# EAGLE design Transmitter Board_REV_2 (EAGLE 5.07)
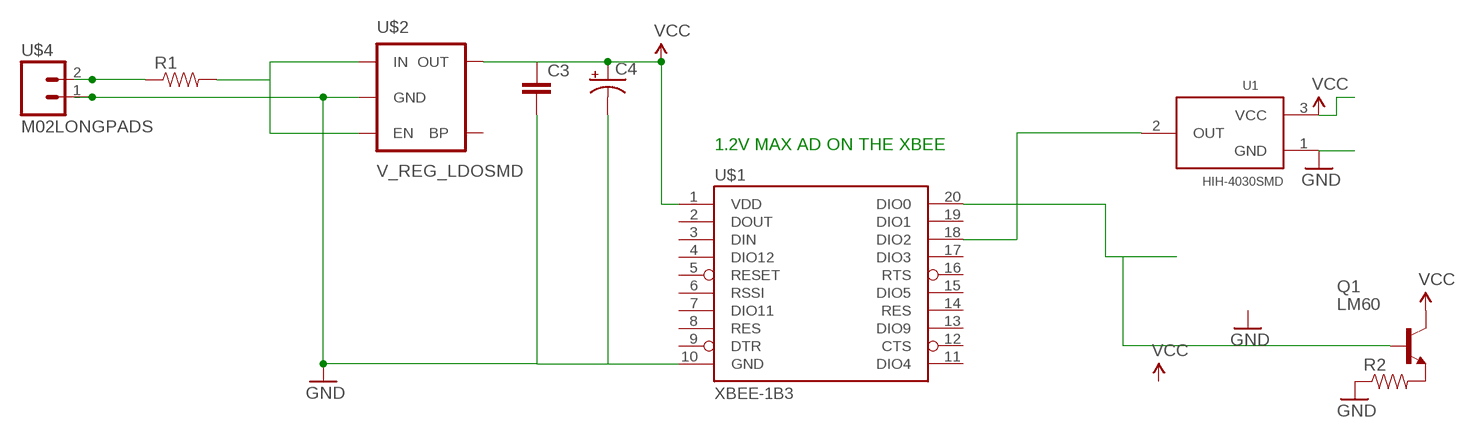
[diagram p0: schematic, sheet 1]

## Parts
C3  CAP0805  [0805]
C4  CAP_POL1206  [EIA3216]
Q1  LM60  BC487  [TO92-EBC]
R1  RESISTOR1206  [1206]
R2  RESISTOR1206  [1206]
U1  HIH-4030SMD  [HIH-4030]
U$1  XBEE-1B3  [XBEE-SMD]
U$2  V_REG_LDOSMD  [SOT23-5]
U$4  M02LONGPADS  [A19423-ELON]

## Nets
GND: C3.2 C4.C(-) R2.1 U1.1(GND) U$1.10(GND) U$2.2(GND) U$4.1
N$1: R1.2 U$2.1(IN) U$2.3(EN)
N$2: U1.2(OUT) U$1.18(DIO2)
N$3: R1.1 U$4.2
N$4: Q1.E R2.2
N$5: Q1.B U$1.20(DIO0)
VCC: C3.1 C4.A(+) Q1.C U1.3(VCC) U$1.1(VDD) U$2.5(OUT)
Unconnected: U$1.2(DOUT) U$1.3(DIN) U$1.4(DIO12) U$1.5(RESET) U$1.6(RSSI) U$1.7(DIO11) U$1.8(RES) U$1.9(DTR) U$1.11(DIO4) U$1.12(CTS) U$1.13(DIO9) U$1.14(RES) U$1.15(DIO5) U$1.16(RTS) U$1.17(DIO3) U$1.19(DIO1) U$2.4(BP)

## Notes on the sheet
- 1.2V MAX AD ON THE XBEE

## Library data of the parts
C3 = SparkFun:CAP: Capacitor Standard 0603 ceramic capacitor, and 0.1" leaded capacitor.
C4 = SparkFun:CAP_POL: Capacitor Polarized These are standard SMD and PTH capacitors. Normally 10uF, 47uF, and 100uF in electrolytic and tantalum varieties. Always verify the external diameter of the through hole cap, it varies with capacity, voltage, and manufacturer. The EIA devices should be standard.
Q1 = transistor-npn:BC487*: NPN Transistor
R1 R2 = SparkFun:RESISTOR: Resistor Basic schematic elements and footprints for 0603, 1206, and PTH 1/10th watt (small) resistors.
U1 = SparkFun:HIH-4030: Humidity Sensor
U$1 = SparkFun:XBEE-1
U$2 = SparkFun:V_REG_LDO: Voltage Regulator LDO Standard 150mA LDO voltage regulator in SOT-23 layout. Micrel part MIC5205. BP (by-pass) pin is used to lower output noise with 470pF cap.
U$4 = _Part Repository:M02: 2-Position Headers

## Board
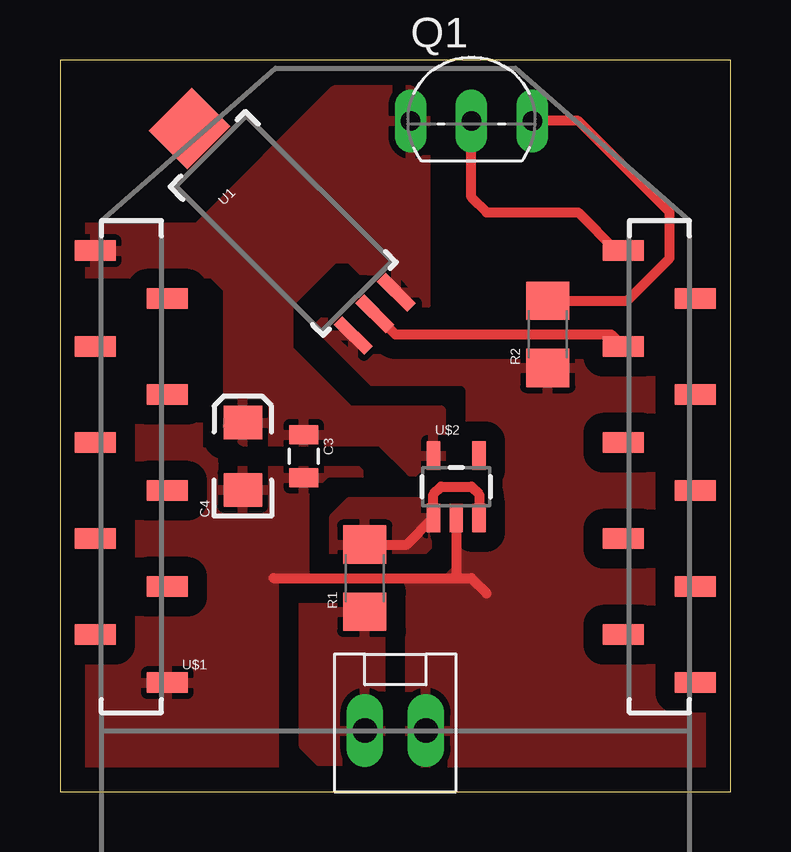
[diagram p1: board, top side]

Size 27.94 x 30.48 mm. Coordinates in mm from the lower left corner, seen from the top.
Outline: 0,0 27.94,0 27.94,30.48 0,30.48 0,0
Copper layers (1*16): Top 0.035mm / dielectric 1.5mm / Bottom 0.035mm
Design rules "default": minimum track width 10mil, minimum drill 24mil, track to track 8mil, track to pad 8mil, pad to pad 8mil, via to via 8mil, smd to smd 8mil, copper to edge 40mil, drill to drill 8mil, minimum pad ring 10mil, minimum via ring 8mil, stop-mask expansion 4mil, vias tented up to drill 0mil, thermal gap 10mil

### Footprints (pad centres in the part's own frame; a part is rotated, then mirrored left to right if it is on the bottom)
0805 = smd 0.8 x 1.2: 1 -0.9,0; 2 0.9,0
EIA3216 = smd 1.4 x 1.6: A 1.4,0; C -1.4,0
TO92-EBC = drill 0.813 long: B 0,-1.27; C -2.54,-1.27; E 2.54,-1.27
1206 = smd 1.6 x 1.8: 1 -1.4,0; 2 1.4,0
HIH-4030 = smd 0.508 x 1.778: 1 -1.27,-5.08; 2 0,-5.08; 3 1.27,-5.08 | smd 2.54 x 2.286: NC 0,5.842
XBEE-SMD = smd 1.7 x 0.85: 1 -12.5,20; 2 -9.5,18; 3 -12.5,16; 4 -9.5,14; 5 -12.5,12; 6 -9.5,10; 7 -12.5,8; 8 -9.5,6; 9 -12.5,4; 10 -9.5,2; 11 12.5,2; 12 9.5,4; 13 12.5,6; 14 9.5,8; 15 12.5,10; 16 9.5,12; 17 12.5,14; 18 9.5,16; 19 12.5,18; 20 9.5,20
SOT23-5 = smd 0.55 x 1.2: 1 -0.95,-1.3; 2 0,-1.3; 3 0.95,-1.3; 4 0.95,1.3; 5 -0.95,1.3
A19423-ELON = drill 1.02 long: 1 1.27,0; 2 -1.27,0

### Placement (x,y rotation side)
C3  10.16,13.97 270 top
C4  7.62,13.97 90 top
Q1  17.14,29.21 0 top
R1  12.7,8.89 90 top
R2  20.32,19.05 90 top
U1  9.53,23.5 45 top
U$1  13.97,2.54 0 top
U$2  16.51,12.7 0 top
U$4  13.97,2.54 0 top

### Tracks (layer width: path | path; a pad name or v marks a point on that pad's centre or on a via)
GND
  Top 0.406: U1.1 12.22,18.9 | U$2.2 16.51,8.89 | 8.89,8.89 17.14,8.89 17.78,8.26
  pour Top (isolate 0.813, rank 2): 3.17,3.81 3.17,5.08 5.08,5.08 6.35,6.35 6.35,12.7 6.99,13.34 11.43,13.34 11.43,10.16 10.79,9.53 9.53,9.53 9.53,3.81 8.89,3.17 3.81,3.17
  pour Top (isolate 0.813, rank 2): 14.61,1.91 14.61,5.71 15.88,6.99 15.88,8.26 16.51,8.89 18.41,8.89 19.05,9.53 19.05,15.88 18.41,16.51 13.34,16.51 10.79,19.05 11.43,19.68 12.06,19.68 13.97,17.78 20.95,17.78 21.59,17.14 21.59,8.26 19.68,6.35 19.68,5.08 16.51,1.91
  pour Top (isolate 0.813, rank 3): 0,0 0,30.48 27.94,30.48 27.94,0
N$1
  Top 0.406: U$2.3 17.46,12.38 17.14,12.7 15.88,12.7 15.56,12.38 U$2.1 14.45,10.29 R1.2
  pour Top (isolate 0.813): 11.43,9.53 11.43,11.43 12.06,12.06 15.88,12.06 15.88,10.79 14.61,9.53
N$2
  Top 0.406: U1.2 13.97,19.05 22.96,19.05 U$1.18
N$3
  pour Top (isolate 0.813): 10.16,8.26 13.34,8.26 13.34,1.27 10.79,1.27 10.16,1.91
N$4
  Top 0.406: R2.2 23.62,20.45 25.4,22.23 25.4,24.13 21.59,27.94 Q1.E
N$5
  Top 0.406: U$1.20 23.18,22.54 21.59,24.13 17.78,24.13 17.14,24.77 Q1.B
VCC
  pour Top (isolate 0.813): 15.88,13.34 15.88,15.88 12.06,15.88 9.53,18.41 9.53,20.32 11.43,22.23 12.06,22.23 14.61,19.68 15.24,20.32 15.24,28.57 14.61,29.21 11.43,29.21 5.71,23.5 0.64,23.5 0.64,21.59 6.35,21.59 6.99,20.95 6.99,15.24 7.62,14.61 13.34,14.61 14.61,13.34